# EAGLE design temp press v2 (EAGLE 9.6.2)
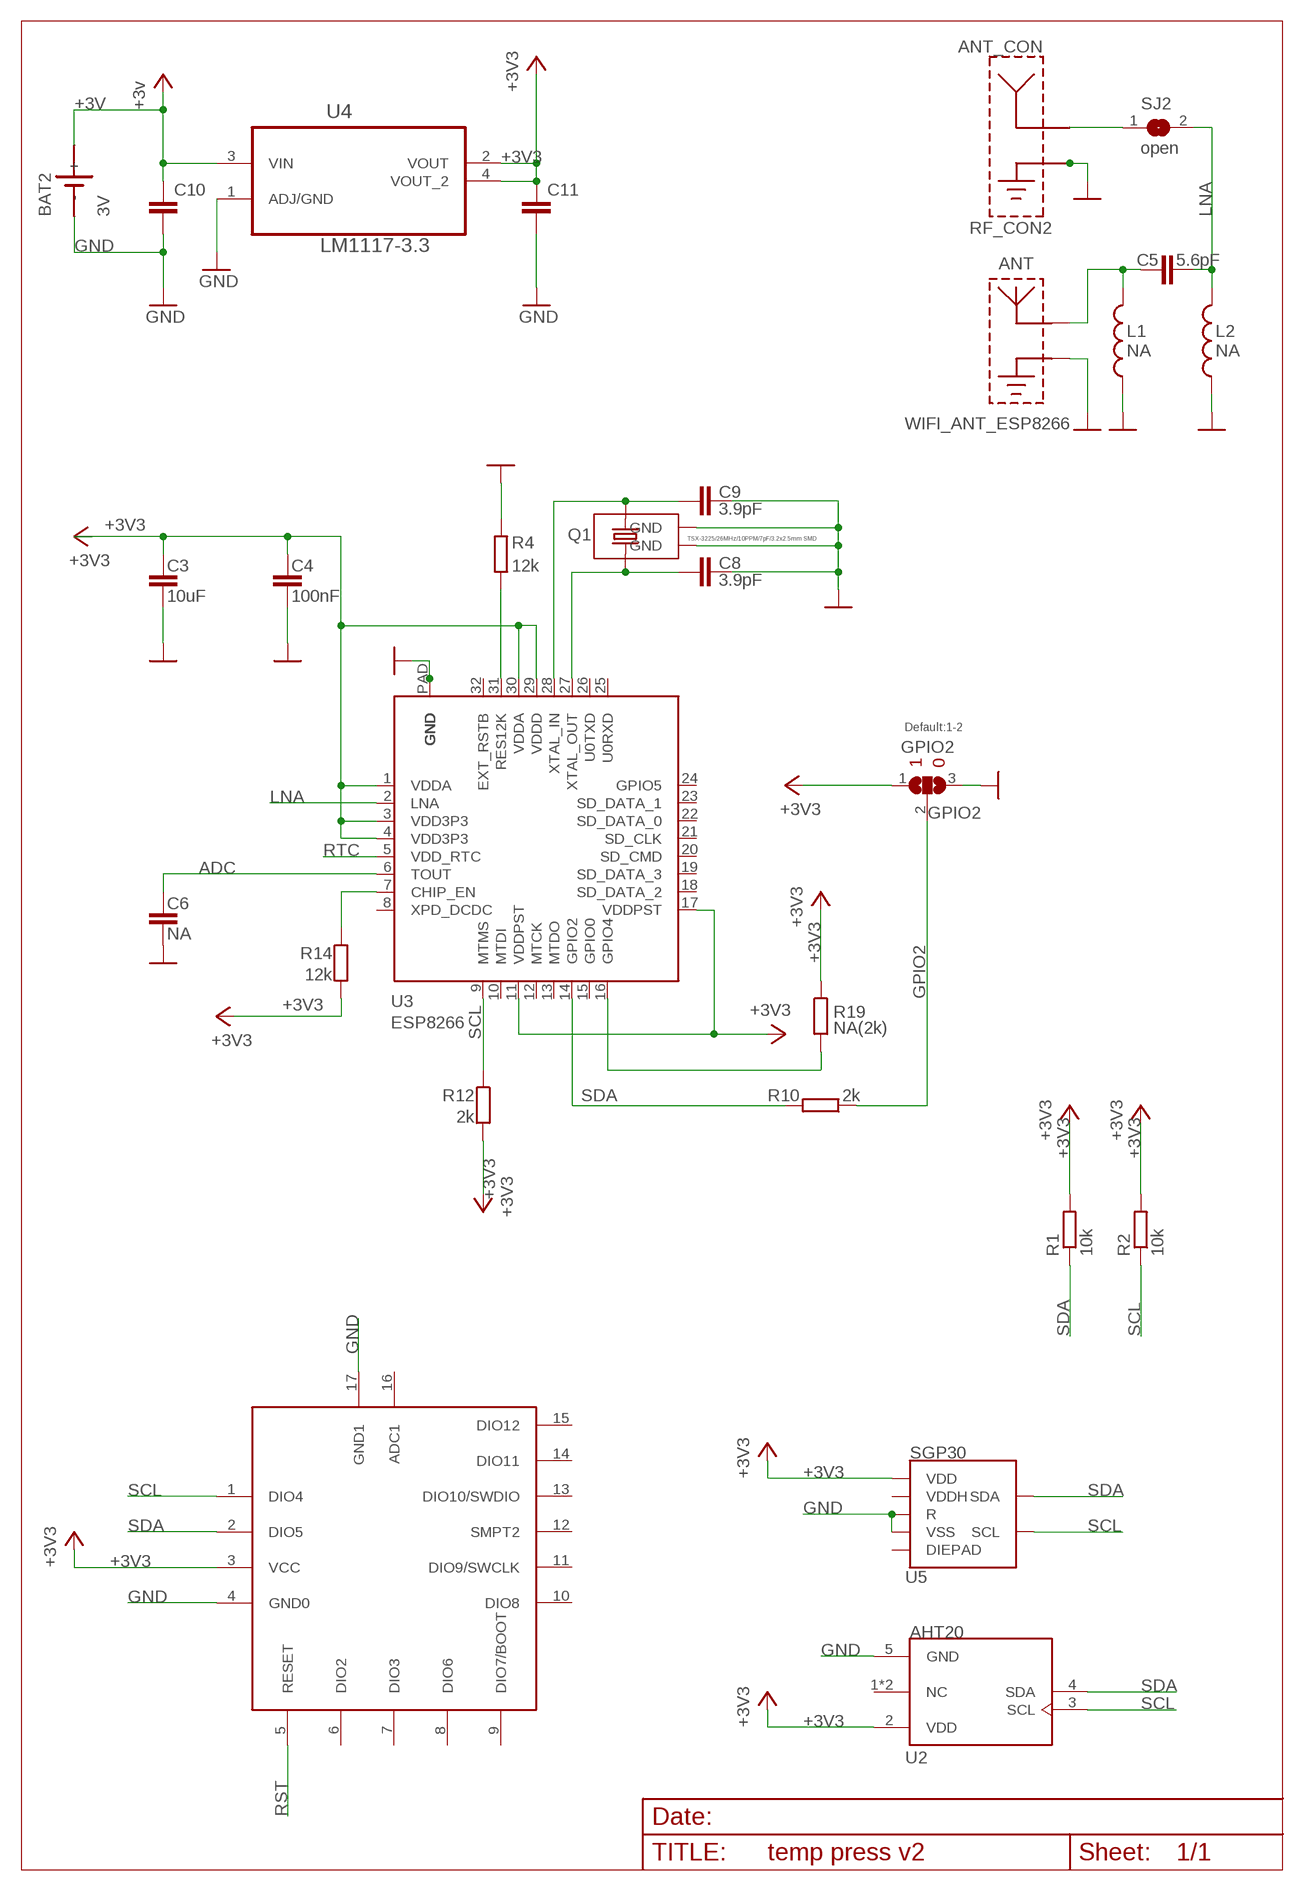
[diagram p0: schematic, sheet 1]

## Parts
ANT  WIFI_ANT_ESP8266  [ESP8266_ANT]
ANT_CON  RF_CON2  [RF_CONNECTOR_I-PEX_NO_CREAM]
BAT2  3V  SN2032  [SN2032]
C3  10uF  C-EUC0603_DWS  [C0603_DWS]
C4  100nF  C-EUC0402_TI  [C0402_TI]
C5  5.6pF  C-EUC0402_TI  [C0402_TI]
C6  NA  C-EUC0402_TI  [C0402_TI]
C8  3.9pF  C-EUC0402_TI  [C0402_TI]
C9  3.9pF  C-EUC0402_TI  [C0402_TI]
C10  47u  C-EUC1206  [C1206]
C11  10u  C-EUC1206  [C1206]
GPIO2  Default:1-2  SJ2W4  [SJ_2_SMALLER]
L1  NA  L-USL0402_TI  [L0402_TI]
L2  NA  L-USL0402_TI  [L0402_TI]
Q1  TSX-3225/26MHz/10PPM/7pF/3.2x2.5mm SMD  SMALL_SMD_CRYSTAL_1  [NX3225SA]
R1  10k  R-EU_R0402  [R0402]
R2  10k  R-EU_R0402  [R0402]
R4  12k  R-EU_R0402_TI  [R0402_TI]
R10  2k  R-EU_R0402_TI  [R0402_TI]
R12  2k  R-EU_R0402_TI  [R0402_TI]
R14  12k  R-EU_R0402_TI  [R0402_TI]
R19  NA(2k)  R-EU_R0402_TI  [R0402_TI]
SJ2  open  SJSJ_SMALLER  [SJ_1_SMALLER]
U2  AHT20  [PSON100P300X300X110-6N]
U3  ESP8266  [QFN32_PAD]
U4  LM1117-3.3  [SOT230]
U5  SGP30  [SGP30]
U$1  BLUENRG-234BLEMODULE  [BLUENRG-234BLEMODULE]

## Nets
+3V [supply]: BAT2.+ C10.1 U4.3(VIN) ; supply symbol labelled +3v
+3V3 [supply]: C3.1 C4.1 C11.1 GPIO2.1 R1.2 R2.2 R12.2 R14.2 R19.1 U2.2(VDD) U3.1(VDDA) U3.3(VDD3P3) U3.4(VDD3P3) U3.11(VDDPST) U3.17(VDDPST) U3.29(VDDD) U3.30(VDDA) U4.2(VOUT) U4.4(VOUT_2) U5.1(VDD) U$1.3(VCC)
ADC: C6.1 U3.6(TOUT)
GND: ANT.GND ANT_CON.1(GND_1) ANT_CON.2(GND_2) BAT2.- C3.2 C4.2 C6.2 C8.1 C9.1 C10.2 C11.2 GPIO2.3 L1.1 L2.1 Q1.NC_1(GND) Q1.NC_2(GND) R4.2 U2.5(GND) U3.P$1(GND) U3.P$2(GND) U3.P$3(GND) U3.P$4(GND) U3.P$5(GND) U3.P$6(GND) U3.P$7(GND) U3.P$8(GND) U3.P$9(GND) U3.PAD(GND) U4.1(ADJ/GND) U5.2(VSS) U5.4(R) U$1.4(GND0) U$1.17(GND1)
GPIO2: GPIO2.2 R10.1
GPIO4: R19.2 U3.16(GPIO4)
LNA: C5.2 L2.2 SJ2.2 U3.2(LNA)
N$7: ANT_CON.ANT SJ2.1
N$11: R14.1 U3.7(CHIP_EN)
N$14: ANT.ANT C5.1 L1.2
N$21: C8.2 Q1.2 U3.27(XTAL_OUT)
N$22: R4.1 U3.31(RES12K)
N$23: C9.2 Q1.1 U3.28(XTAL_IN)
RST: U$1.5(RESET)
RTC: U3.5(VDD_RTC)
SCL: R2.1 R12.1 U2.3(SCL) U3.9(MTMS) U5.6(SCL) U$1.1(DIO4)
SDA: R1.1 R10.2 U2.4(SDA) U3.14(GPIO2) U5.3(SDA) U$1.2(DIO5)
Unconnected: U2.1(NC) U2.6(NC) U3.8(XPD_DCDC) U3.10(MTDI) U3.12(MTCK) U3.13(MTDO) U3.15(GPIO0) U3.18(SD_DATA_2) U3.19(SD_DATA_3) U3.20(SD_CMD) U3.21(SD_CLK) U3.22(SD_DATA_0) U3.23(SD_DATA_1) U3.24(GPIO5) U3.25(U0RXD) U3.26(U0TXD) U3.32(EXT_RSTB) U5.5(VDDH) U5.DIEPAD U$1.6(DIO2) U$1.7(DIO3) U$1.8(DIO6) U$1.9(DIO7/BOOT) U$1.10(DIO8) U$1.11(DIO9/SWCLK) U$1.12(SMPT2) U$1.13(DIO10/SWDIO) U$1.14(DIO11) U$1.15(DIO12) U$1.16(ADC1)

## Notes on the sheet
- 1 | 0

## Library data of the parts
ANT = OLIMEX_ANT:WIFI_ANT_ESP8266
ANT_CON = OLIMEX_CONNECTORS:RF_CON
BAT2 = sn2032:SN2032: LI BATTERY
C3-C6 C8 C9 = rcl:C-EU: CAPACITOR, European symbol
C10 C11 = rcl:C-EU: CAPACITOR, European symbol; SPICEPREFIX: C
GPIO2 = jumper:SJ2W: SMD solder JUMPER
L1 L2 = rcl:L-US: INDUCTOR, American symbol
Q1 = OLIMEX_DISCRET:SMALL_SMD_CRYSTAL
R1 R2 = rcl:R-EU_: RESISTOR, European symbol; SPICEPREFIX: R
R4 R10 R12 R14 R19 = rcl:R-EU_: RESISTOR, European symbol
SJ2 = jumper:SJ: SMD solder JUMPER
U2 = AHT20:AHT20: Temperature and Humidity sensor Check availability <https://pricing.snapeda.com/parts/AHT20/Asair/view-part?ref=eda>; AVAILABILITY: Not in stock; DESCRIPTION: Temperature and Humidity sensor; MF: Asair; MP: AHT20; PACKAGE: Package; PRICE: None
U3 = OLIMEX_IC:ESP8266
U4 = LM1117-3.3:LM1117-3.3: IC REG LDO 800MA 3.3V Check prices <https://pricing.snapeda.com/parts/LM1117-3.3/Texas%20Instruments/view-part?ref=eda>; AVAILABILITY: In Stock; DESCRIPTION: Linear Voltage Regulator IC Positive Fixed 1 Output 800mA DDPAK/TO-263-3; MF: Texas Instruments; MP: LM1117-3.3; PACKAGE: None; PRICE: None
U5 = SGP30:SGP30: The SGP30 is a digital multi-pixel gas sensor designed for easy integration into air purifier, demand-controlled ventilation, and IoT applications. Check availability <https://pricing.snapeda.com/parts/SGP30/Sensirion%20AG/view-part?ref=eda>; AVAILABILITY: In Stock; DESCRIPTION: SGP30, SHTC1 Air Quality, Humidity, Temperature Sensor Arduino Platform Evaluation Expansion Board; MF: Sensirion AG; MP: SGP30; PACKAGE: None; PRICE: None
U$1 = BLUENRG-234blemodule:BLUENRG-234BLEMODULE: BLUENRG-234 BLE Module

## Net classes
1 supply: width 0.406 mm, clearance 0.203 mm

## Board
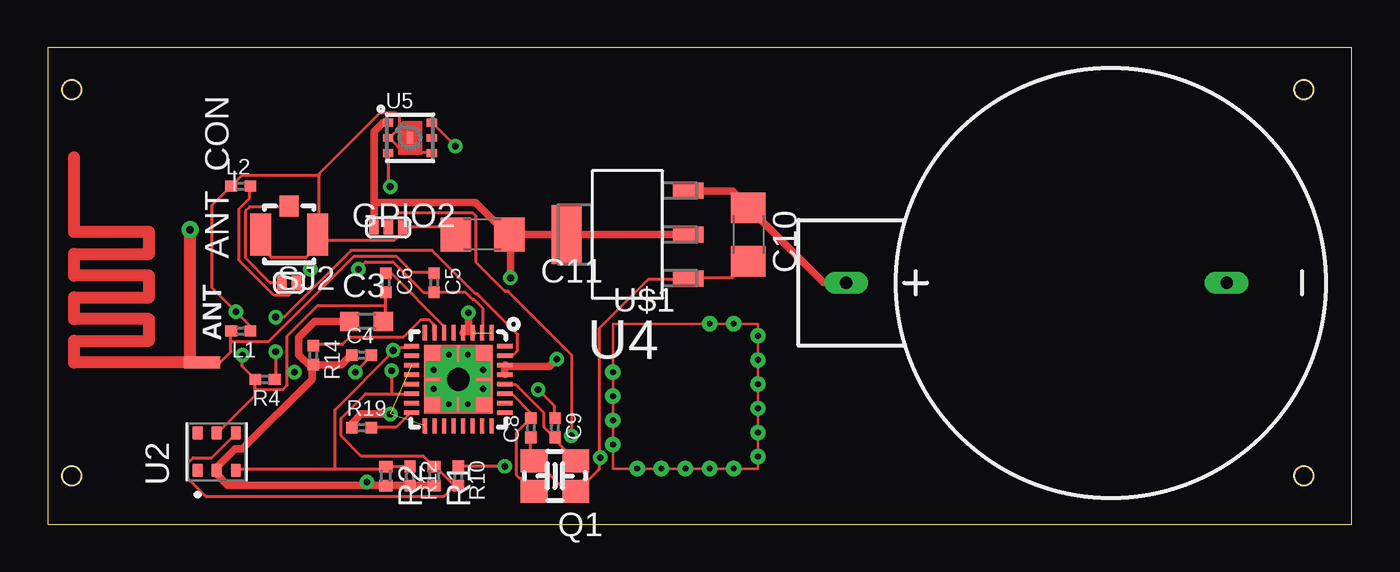
[diagram p1: board, top side]
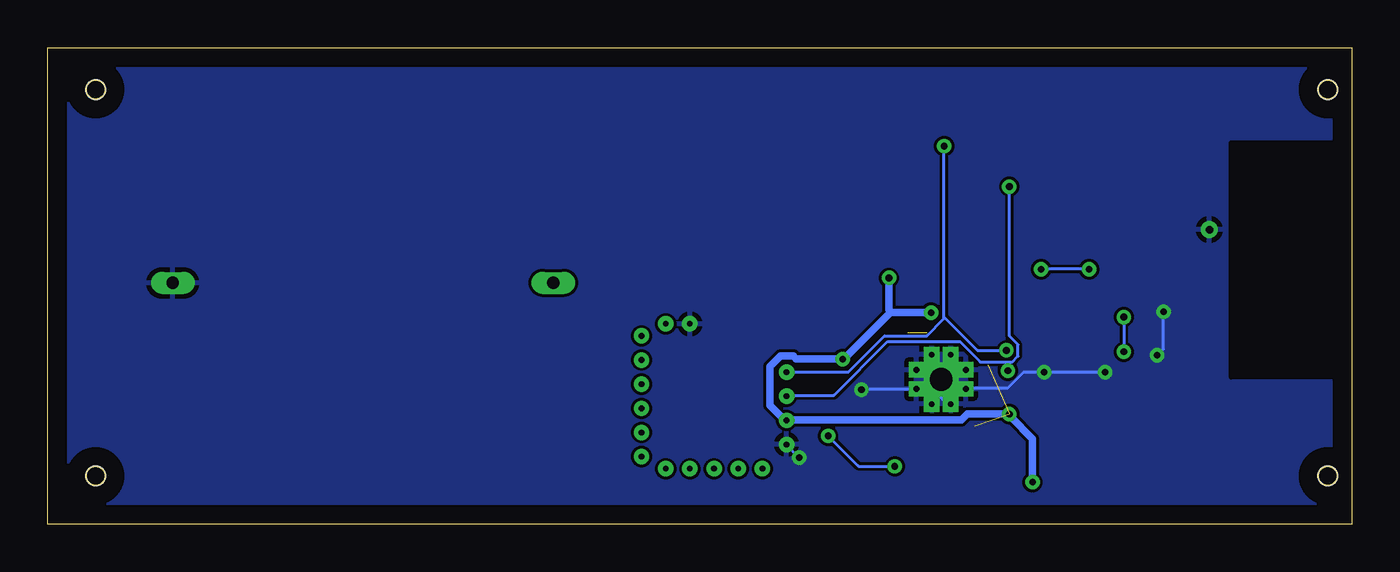
[diagram p2: board, bottom side, seen from below]

Size 68.56 x 25.07 mm. Coordinates in mm from the lower left corner, seen from the top.
Outline: 0.77,2.51 arc174 1.77,2.51 1.77,2.57 arc174 0.77,2.57 0.77,2.51
Outline: 0.77,22.83 arc174 1.77,22.83 1.77,22.89 arc174 0.77,22.89 0.77,22.83
Outline: 65.54,22.83 arc174 66.54,22.83 66.54,22.89 arc174 65.54,22.89 65.54,22.83
Outline: 65.54,2.51 arc174 66.54,2.51 66.54,2.57 arc174 65.54,2.57 65.54,2.51
Outline: 0,25.07 0,0 68.56,0 68.56,25.07 0,25.07
Copper layers (1*16): Top 0.035mm / dielectric 1.5mm / Bottom 0.035mm
Design rules "default": minimum track width 6mil, minimum drill 0.35mm, track to track 6mil, track to pad 6mil, pad to pad 6mil, via to via 6mil, smd to smd 6mil, copper to edge 40mil, drill to drill 6mil, minimum pad ring 10mil, minimum via ring 8mil, stop-mask expansion 4mil, vias tented up to drill 0mil, thermal gap 10mil
Holes 1 mm at 1.27,2.54 1.27,22.86 66.04,22.86 66.04,2.54

### Footprints (pad centres in the part's own frame; a part is rotated, then mirrored left to right if it is on the bottom)
ESP8266_ANT = smd 0.635 x 1.905: ANT -5.334,-3.302 | drill 0.4 pad 0.635: GND 1.651,-2.667
RF_CONNECTOR_I-PEX_NO_CREAM = smd 2.2 x 1.1: 1 0,1.5; 2 0,-1.5 | smd 1.1 x 1: ANT 1.5,0
SN2032 = drill 0.65 long: + 0,13.9; - 0,-6.1
C0603_DWS = smd 1.016 x 1.016: 1 -0.889,0; 2 0.889,0
C0402_TI = smd 0.61 x 0.584: 1 -0.508,0; 2 0.508,0
C1206 = smd 1.6 x 1.8: 1 -1.4,0; 2 1.4,0
SJ_2_SMALLER = smd 0.508 x 0.762: 1 -0.762,0; 2 0,0; 3 0.762,0
L0402_TI = smd 0.61 x 0.584: 1 -0.508,0; 2 0.508,0
NX3225SA = smd 1.4 x 1.2: 1 -1.1,-0.8; 2 1.1,0.8; NC_1 1.1,-0.8; NC_2 -1.1,0.8
R0402 = smd 0.6 x 0.7: 1 -0.5,0; 2 0.5,0
R0402_TI = smd 0.61 x 0.584: 1 -0.508,0; 2 0.508,0
SJ_1_SMALLER = smd 0.508 x 0.762: 1 -0.381,0; 2 0.381,0
PSON100P300X300X110-6N = smd 0.71 x 0.53: 1 -0.985,1; 2 -0.985,0; 3 -0.985,-1; 4 0.985,-1; 5 0.985,0; 6 0.985,1
QFN32_PAD = smd 0.8 x 0.23: 1 -2.45,1.75; 2 -2.45,1.25; 3 -2.45,0.75; 4 -2.45,0.25; 5 -2.45,-0.25; 6 -2.45,-0.75; 7 -2.45,-1.25; 8 -2.45,-1.75; 17 2.45,-1.75; 18 2.45,-1.25; 19 2.45,-0.75; 20 2.45,-0.25; 21 2.45,0.25; 22 2.45,0.75; 23 2.45,1.25; 24 2.45,1.75 | smd 0.23 x 0.8: 9 -1.75,-2.45; 10 -1.25,-2.45; 11 -0.75,-2.45; 12 -0.25,-2.45; 13 0.25,-2.45; 14 0.75,-2.45; 15 1.25,-2.45; 16 1.75,-2.45; 25 1.75,2.45; 26 1.25,2.45; 27 0.75,2.45; 28 0.25,2.45; 29 -0.25,2.45; 30 -0.75,2.45; 31 -1.25,2.45; 32 -1.75,2.45 | drill 1.2 pad 1.422 square: P$1 0,0 | drill 0.3 pad 0.4 square: P$2 0.5,1.3; P$3 -0.5,1.3; P$4 -1.3,0.5; P$5 -1.3,-0.5; P$6 -0.5,-1.3; P$7 0.5,-1.3; P$8 1.3,-0.5; P$9 1.3,0.5 | smd 3.6 x 3.6: PAD 0,0
SOT230 = smd 1.6 x 0.838: 1 -3.2,2.311; 2 -3.2,0; 3 -3.2,-2.311 | smd 1.6 x 3.099: 4 3.2,0
SGP30 = smd 0.55 x 0.4: 1 -1.15,0.8; 2 -1.15,0; 3 -1.15,-0.8; 4 1.15,-0.8; 5 1.15,0; 6 1.15,0.8 | smd 0.305 x 0.61: DIEPAD 0,0
BLUENRG-234BLEMODULE = drill 0.3 pad 0.813: 1 -3.81,1.27 | drill 0.3: 2 -3.81,0; 3 -3.81,-1.27; 4 -3.81,-2.54; 5 -2.54,-3.81; 6 -1.27,-3.81; 7 0,-3.81; 8 1.27,-3.81; 9 2.54,-3.81; 10 3.81,-3.175; 11 3.81,-1.905; 12 3.81,-0.635; 13 3.81,0.635; 14 3.81,1.905; 15 3.81,3.175; 16 2.54,3.81; 17 1.27,3.81

### Placement (x,y rotation side)
ANT  4.83,13.84 90 top
ANT_CON  12.7,15.24 90 top
BAT2  55.88,12.7 90 top
C3  16.76,10.67 0 top
C4  16.51,8.89 0 top
C5  20.32,12.7 270 top
C6  17.78,12.7 270 top
C8  25.4,5.08 90 top
C9  26.67,5.08 270 top
C10  36.83,15.24 270 top
C11  22.86,15.24 180 top
GPIO2  17.91,15.62 0 top
L1  10.16,10.16 180 top
L2  10.16,17.78 0 top
Q1  26.67,2.54 180 top
R1  20.32,2.54 270 top
R2  17.78,2.54 270 top
R4  11.43,7.62 180 top
R10  21.59,2.54 270 top
R12  19.05,2.54 270 top
R14  13.97,8.89 270 top
R19  16.51,5.08 0 top
SJ2  12.7,12.7 0 top
U2  8.89,3.81 90 top
U3  21.59,7.62 270 top
U4  30.48,15.24 180 top
U5  19.05,20.32 0 top
U$1  33.53,6.73 0 top

### Tracks (layer width: path | path; a pad name or v marks a point on that pad's centre or on a via)
+3V
  Top 0.406: U4.3 33.71,17.53 35.99,17.53 36.83,16.69 C10.1 36.98,16.54 40.79,12.72 41.93,12.72 BAT2.+
+3V3  (via drill 0.35)  (3 unrouted)
  Top 0.406: 17.17,16.92 17.17,15.62 GPIO2.1 | 17.17,16.92 17.17,20.65 17.63,21.11 17.86,21.11 U5.1 | U4.2 U4.4 C11.1 | 17.17,16.92 22.5,16.92 24.11,15.32 C11.1 | R1.2 20.3,2.06 19.07,2.06 R12.2 18.92,2.06 17.78,2.06 R2.2 17.63,2.06 16.79,2.06 | R14.2 15.42,8.38 15.95,8.91 C4.1 | R14.2 13.89,8.23 13.89,7.62 10.24,3.96 9.86,3.96 8.94,3.05 8.94,2.9 U2.2 8.87,2.67 9.47,2.06 16.79,2.06 | C3.1 14.05,10.67 13.21,9.83 13.21,8.91 13.82,8.31 R14.2 | 22.12,10.13 22.28,10.13 U3.3 | 22.12,10.13 21.89,10.13 U3.4 | U3.29 24.03,7.92 24.03,8.31 U3.30 24.18,8.31 26.39,8.31 v26.77,8.69 | v18.01,5.79 16.48,5.79 16.03,5.33 16.03,5.11 R19.1 | v22.12,11.12 22.12,10.13 | v16.79,2.21 16.79,2.06 | v24.33,12.95 24.33,15.09 C11.1
  Bottom 0.406: 24.26,11.12 v22.12,11.12 | 24.26,11.12 26.62,8.76 v26.77,8.69 29.21,8.69 29.36,8.84 30.05,8.84 30.58,8.31 30.58,6.25 29.9,5.56 U$1.3 29.67,5.49 20.52,5.49 20.22,5.79 v18.01,5.79 17.93,5.64 16.79,4.5 v16.79,2.21 | v24.33,12.95 24.33,11.28 24.26,11.12
ADC
  Top 0.152: C6.1 17.78,13.18 18.09,13.18 20.83,10.44 20.83,10.13 U3.6
GND  (via drill 0.35)
  Top 0.152: C8.1 25.4,3.5 25.55,3.35 Q1.NC_1 25.63,3.35 27.23,1.75 27.76,1.75 Q1.NC_2 27.84,1.75 28.98,2.9 28.98,3.5 | C10.2 36.83,13.79 35.99,12.95 33.71,12.95 U4.1 33.63,12.88 31.57,12.88 28.98,10.29 28.98,3.5 | C11.2 21.44,15.24 21.06,15.62 GPIO2.3 18.62,15.62 18.62,15.32 18.24,14.94 14.2,14.94 | U5.4 20.14,19.58 18.69,19.58 17.93,20.34 U5.2 18.01,20.34 18.47,20.8 18.47,21.49 18.31,21.64 17.48,21.64 14.28,18.44 14.28,18.36 | 14.28,18.36 14.28,15.24 ANT_CON.2 | 14.2,14.94 ANT_CON.2 | 14.2,14.94 14.2,14.63 13.59,14.02 11.76,14.02 11.23,14.55 11.23,15.24 ANT_CON.1 | 14.2,14.94 ANT_CON.2 | 17.78,11.51 17.78,10.74 17.7,10.67 C3.2 | 17.78,11.51 C6.2 | 10.92,7.09 10.92,6.78 8.94,4.8 U2.5 | 10.92,7.09 R4.2 10.23,8.31 v10.23,8.89 | 17.78,11.51 14.2,11.51 12.6,9.91 12.6,8 | 12.6,8 12.6,7.32 12.37,7.09 10.92,7.09 | 9.7,17.75 L2.1 | v16.18,8 17.02,8.84 C4.2 | v25.78,7.09 26.62,6.25 26.62,5.64 C9.1 | v12.98,8 12.6,8 | 14.28,18.36 10.24,18.36 L2.1 | v29.06,3.5 28.98,3.5 | L1.1 10.67,10.41 v9.91,11.18 8.64,12.45 8.64,16.76 L2.1
  Bottom 0.152: U3.P$7 20.22,7.16 18.09,7.16 17.25,8 v16.18,8 v12.98,8 | v25.78,7.09 22.96,7.09 U3.P$2 | U3.P$1 21.59,6.63 21.36,6.4 21.13,6.4 21.13,6.48 21.21,6.55 21.29,6.55 21.29,6.48 21.21,6.48 21.13,6.55 20.9,6.55 20.83,6.48 20.83,6.17 20.98,6.02 21.13,6.02 21.29,6.17 21.36,6.17 21.44,6.25 U3.P$8 | v29.06,3.5 29.74,4.19 U$1.4 | v10.23,8.89 9.91,9.22 v9.91,11.18
  pour Bottom: -3.81,27.94 -3.81,-3.81 72.39,-3.81 72.39,27.94
GPIO2  (via drill 0.35)
  Top 0.152: v24.03,3.05 R10.1 | v27.53,4.65 27.53,8.91 24.18,12.27 24.03,12.27 22.5,13.79 22.5,16.23 22.35,16.38 18.47,16.38 17.93,15.85 17.93,15.62 GPIO2.2
  Bottom 0.152: v24.03,3.05 25.93,3.05 v27.53,4.65
GPIO4
  Top 0.152: R19.2 17.02,5.11 18.31,5.11 19.07,5.87 U3.16
LNA  (via drill 0.35)
  Top 0.152: U3.2 22.89,10.13 22.89,11.35 22.43,11.81 22.35,11.81 21.97,12.19 C5.2 19.76,12.19 18.16,13.79 16.71,13.79 v16.33,13.41 | L2.2 10.62,17.75 10.62,17.14 10.08,16.61 10.08,13.87 11.91,12.04 12.68,12.04 13.06,12.42 13.06,12.65 SJ2.2 13.13,12.72 v13.82,13.41
  Bottom 0.152: v13.82,13.41 v16.33,13.41
N$7
  Top 0.152: SJ2.1 12.29,12.72 11.68,12.72 10.39,14.02 10.39,16.46 10.62,16.69 12.68,16.69 ANT_CON.ANT
N$11
  Top 0.152: R14.1 13.97,9.45 15.49,9.45 15.88,9.83 18.69,9.83 19.61,10.74 20.07,10.74 20.3,10.52 20.3,10.13 U3.7
N$14
  Top 0.152: 9.63,9.6 9.63,9.07 9.09,8.53 8.18,8.53 ANT.ANT | 9.63,9.6 9.63,10.13 L1.2 | 9.63,9.6 11.61,9.6 16.1,14.1 18.31,14.1 19.15,13.26 20.3,13.26 C5.1
N$21
  Top 0.152: U3.27 24.11,6.86 24.41,6.86 25.4,5.87 C8.2 25.4,5.56 24.64,4.8 24.64,2.59 24.79,2.44 24.87,2.44 25.55,1.75 Q1.2
N$22  (via drill 0.35)
  Top 0.152: v11.99,9.07 11.99,7.62 R4.1 | v11.99,10.9 12.45,10.9 15.95,14.4 20.22,14.4 22.5,12.12 22.58,12.12 24.71,9.98 24.71,9.14 24.49,8.91 24.11,8.91 U3.31
  Bottom 0.152: v11.99,10.9 v11.99,9.07
N$23
  Top 0.152: Q1.1 27.76,3.35 26.7,4.42 26.7,4.57 C9.2 26.62,4.57 26.09,5.11 26.09,5.87 24.64,7.32 24.11,7.32 U3.28
SCL  (via drill 0.35)
  Top 0.152: R12.1 R2.1 17.78,2.97 17.7,2.9 15.11,2.9 | 15.11,2.9 9.93,2.9 U2.3 | 18.2,9.11 15.11,6.02 15.11,2.9 | 18.2,9.11 18.39,9.3 19.07,9.3 U3.9 | v21.44,19.89 20.22,21.11 U5.6 | v18.16,9.14 18.2,9.11
  Bottom 0.152: 21.44,10.9 21.44,10.82 22.35,9.91 24.56,9.91 26.47,8 U$1.1 | 21.44,10.9 v21.44,19.89 | v18.16,9.14 19.68,9.14 21.44,10.9
SDA  (via drill 0.35)
  Top 0.152: 21.44,2.06 21.36,2.06 20.37,3.05 R1.1 20.3,3.05 19.76,3.58 16.48,3.58 15.42,4.65 15.42,5.56 16.71,6.86 18.09,6.86 | 21.44,2.06 21.59,2.06 R10.2 21.44,2.06 | 21.44,2.06 20.83,1.45 8.33,1.45 7.34,2.44 7.34,3.2 7.64,3.5 8.64,3.5 9.86,4.72 U2.4 | 18.09,6.86 19.07,6.86 U3.14 | v18.01,17.75 17.93,17.83 17.93,19.51 U5.3 | v18.09,8.08 18.09,6.86
  Bottom 0.152: v18.01,17.75 18.01,9.91 17.55,9.45 17.55,8.84 17.86,8.53 18.09,8.53 | 18.09,8.53 19.53,8.53 20.6,9.6 24.41,9.6 27.23,6.78 29.67,6.78 U$1.2 | 18.09,8.53 v18.09,8.08